# EAGLE design ChessMate (EAGLE 7.2.0)
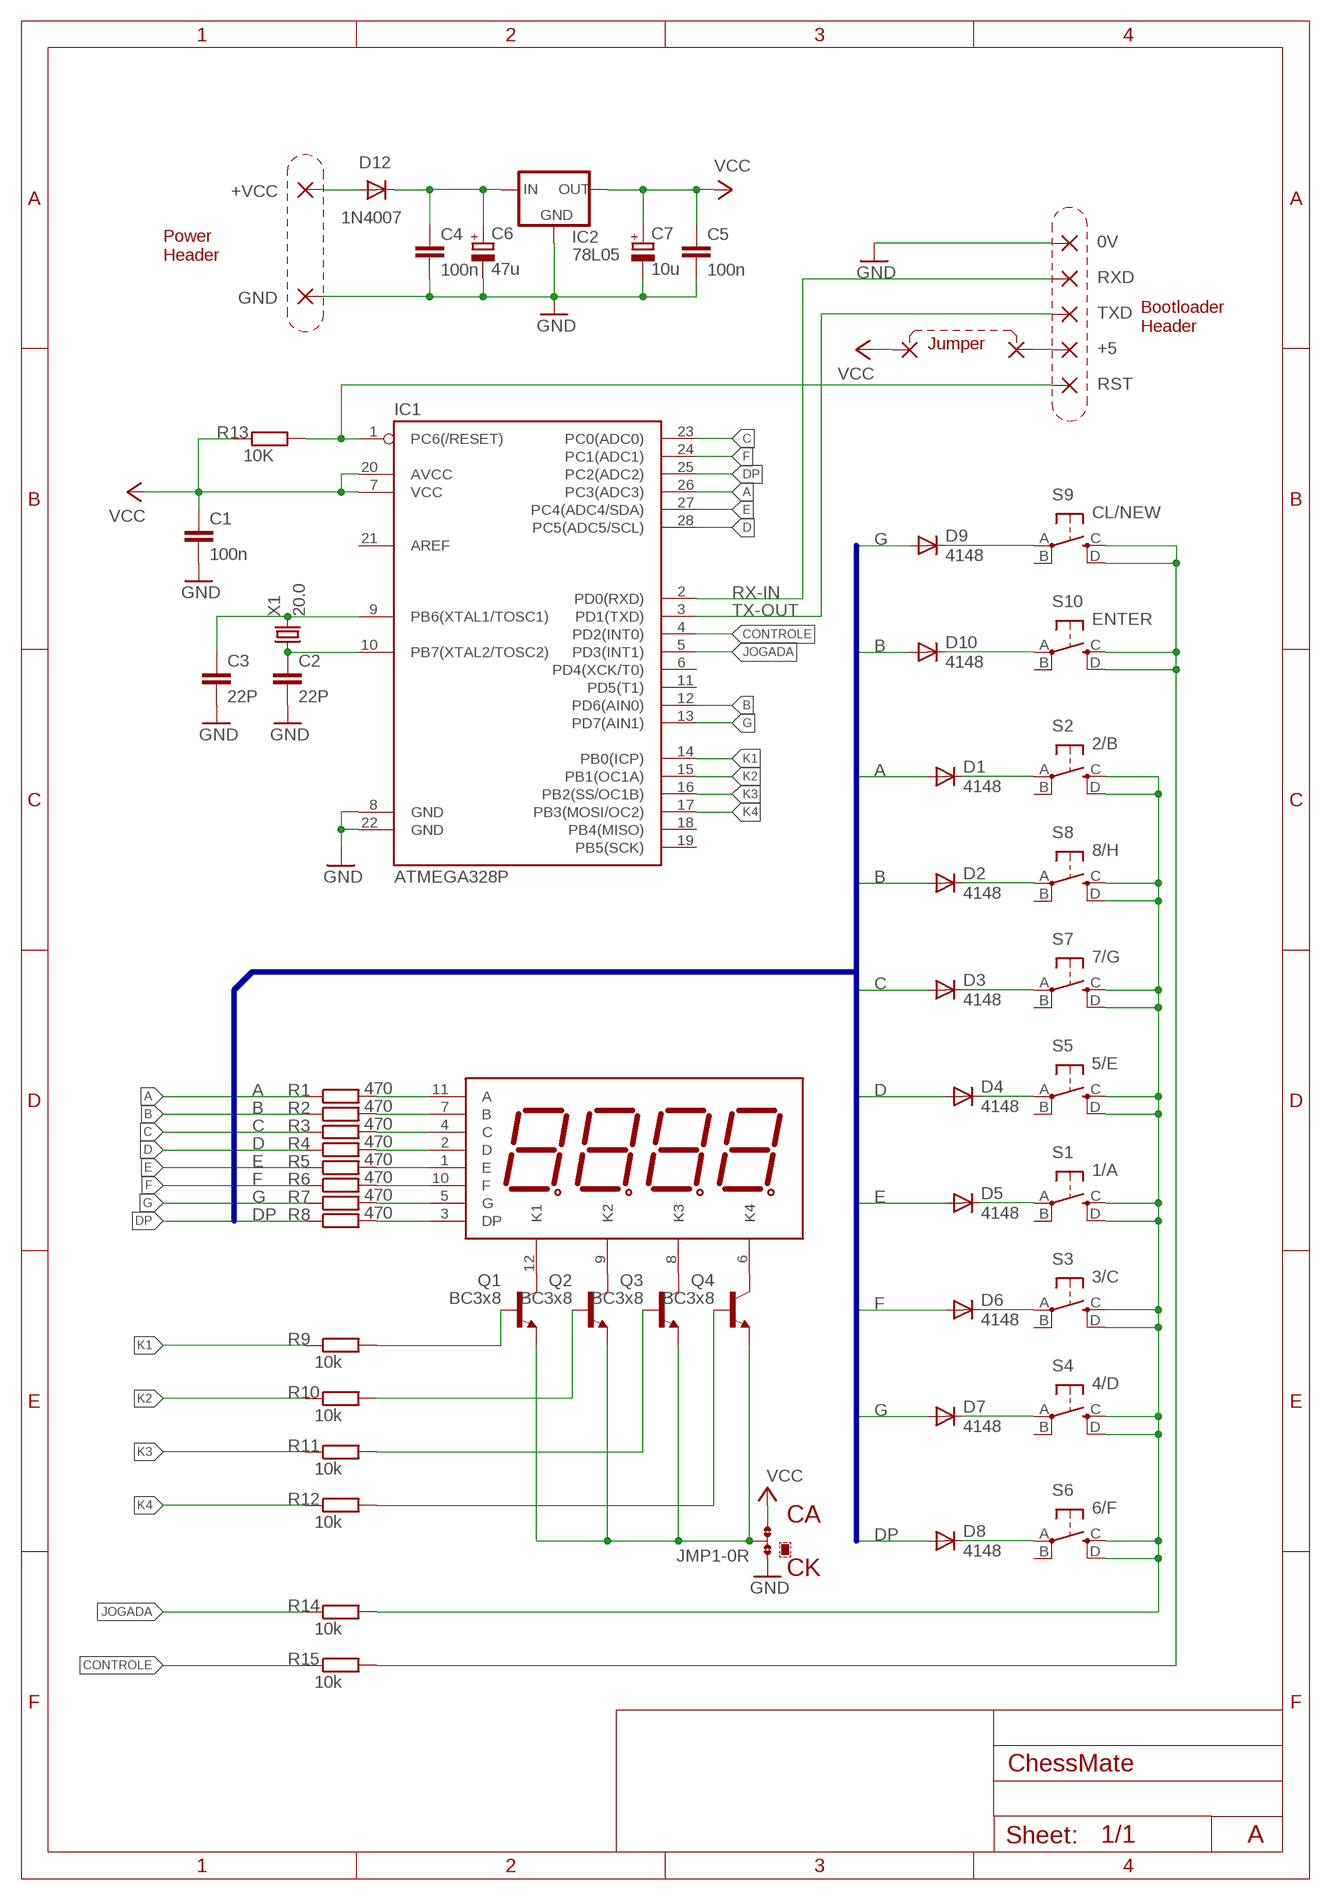
[diagram p0: schematic, sheet 1]

## Parts
0V  2,15/1,0  [2,15/1,0]
+5  2,15/1,0  [2,15/1,0]
+VCC  2,15/1,0  [2,15/1,0]
C1  100n  C-EUC050-024X044L  [C050-024X044L]
C2  22P  C-EU  [C025-024X044L]
C3  22P  C-EU  [C025-024X044L]
C4  100n  C-EUC050-024X044L  [C050-024X044L]
C5  100n  C-EUC050-024X044L  [C050-024X044L]
C6  47u  CPOL-EUTT2D7L  [TT2D7L]
C7  10u  CPOL-EUTT2D7L  [TT2D7L]
D1  4148  1N4148DO35-7  [DO35-7]
D2  4148  1N4148DO35-7  [DO35-7]
D3  4148  1N4148DO35-7  [DO35-7]
D4  4148  1N4148DO35-7  [DO35-7]
D5  4148  1N4148DO35-7  [DO35-7]
D6  4148  1N4148DO35-7  [DO35-7]
D7  4148  1N4148DO35-7  [DO35-7]
D8  4148  1N4148DO35-7  [DO35-7]
D9  4148  1N4148DO35-7  [DO35-7]
D10  4148  1N4148DO35-7  [DO35-7]
D12  1N4007  DIODE-DO41-7.7L  [DO41-7.6L]
GND  2,15/1,0  [2,15/1,0]
IC1  ATMEGA328P  ATMEGA328P_PDIP  [DIL28-3]
IC2  78L05  78LXXTO92_  [TO92_]
JMP1  0R-JUMPA  [A0R-JMP]
LD1  4_DIGIT-TOF3461BH-N  [TOF3461BH-N]
PAD1  1,6/0,8  [1,6/0,8]
PAD2  1,6/0,8  [1,6/0,8]
Q1  BC3x8  BC338  [TO92-EBC]
Q2  BC3x8  BC338  [TO92-EBC]
Q3  BC3x8  BC338  [TO92-EBC]
Q4  BC3x8  BC338  [TO92-EBC]
R1  470  R-EU_0204/7L  [0204/7L]
R2  470  R-EU_0204/7L  [0204/7L]
R3  470  R-EU_0204/7L  [0204/7L]
R4  470  R-EU_0204/7L  [0204/7L]
R5  470  R-EU_0204/7L  [0204/7L]
R6  470  R-EU_0204/7L  [0204/7L]
R7  470  R-EU_0204/7L  [0204/7L]
R8  470  R-EU_0204/7L  [0204/7L]
R9  10k  R-EU_0204/7L  [0204/7L]
R10  10k  R-EU_0204/7L  [0204/7L]
R11  10k  R-EU_0204/7L  [0204/7L]
R12  10k  R-EU_0204/7L  [0204/7L]
R13  10K  R-EU_0204/5L  [0204/5L]
R14  10k  R-EU_0204/7L  [0204/7L]
R15  10k  R-EU_0204/7L  [0204/7L]
RST  2,15/1,0  [2,15/1,0]
RXD  2,15/1,0  [2,15/1,0]
S1  1/A  10-XXTACT  [TACT_SW]
S2  2/B  10-XXTACT  [TACT_SW]
S3  3/C  10-XXTACT  [TACT_SW]
S4  4/D  10-XXTACT  [TACT_SW]
S5  5/E  10-XXTACT  [TACT_SW]
S6  6/F  10-XXTACT  [TACT_SW]
S7  7/G  10-XXTACT  [TACT_SW]
S8  8/H  10-XXTACT  [TACT_SW]
S9  CL/NEW  10-XXTACT  [TACT_SW]
S10  ENTER  10-XXTACT  [TACT_SW]
TXD  2,15/1,0  [2,15/1,0]
X1  20.0  CRYSTALHC49/SL  [HC49/SL]

## Nets
A: D1.A IC1.26(PC3(ADC3)) R1.1
B: D2.A D10.A IC1.12(PD6(AIN0)) R2.1
C: D3.A IC1.23(PC0(ADC0)) R3.1
CONTROLE: IC1.4(PD2(INT0)) R15.1
CONTROLE_: R15.2 S9.C(S) S9.D(S1) S10.C(S) S10.D(S1)
D: D4.A IC1.28(PC5(ADC5/SCL)) R4.1
DP: D8.A IC1.25(PC2(ADC2)) R8.1
E: D5.A IC1.27(PC4(ADC4/SDA)) R5.1
F: D6.A IC1.24(PC1(ADC1)) R6.1
G: D7.A D9.A IC1.13(PD7(AIN1)) R7.1
GND: 0V.1(P) C1.2 C2.2 C3.2 C4.2 C5.2 C6.- C7.- GND.1(P) IC1.8(GND) IC1.22(GND) IC2.2(GND) JMP1.1
JOGADA: IC1.5(PD3(INT1)) R14.1
JOGADA_C: R14.2 S1.C(S) S1.D(S1) S2.C(S) S2.D(S1) S3.C(S) S3.D(S1) S4.C(S) S4.D(S1) S5.C(S) S5.D(S1) S6.C(S) S6.D(S1) S7.C(S) S7.D(S1) S8.C(S) S8.D(S1)
K1: IC1.14(PB0(ICP)) R9.1
K2: IC1.15(PB1(OC1A)) R10.1
K3: IC1.16(PB2(SS/OC1B)) R11.1
K4: IC1.17(PB3(MOSI/OC2)) R12.1
N$1: LD1.11(A) R1.2
N$2: LD1.7(B) R2.2
N$3: LD1.4(C) R3.2
N$4: LD1.2(D) R4.2
N$5: LD1.1(E) R5.2
N$6: LD1.10(F) R6.2
N$7: LD1.5(G) R7.2
N$8: LD1.3(DP) R8.2
N$9: Q1.B R9.2
N$10: Q2.B R10.2
N$11: Q3.B R11.2
N$12: Q4.B R12.2
N$13: LD1.12(K1) Q1.C
N$14: LD1.9(K2) Q2.C
N$15: LD1.8(K3) Q3.C
N$16: LD1.6(K4) Q4.C
N$17: IC1.1(PC6(/RESET)) R13.2 RST.1(P)
N$18: C3.1 IC1.9(PB6(XTAL1/TOSC1)) X1.2
N$19: C2.1 IC1.10(PB7(XTAL2/TOSC2)) X1.1
N$20: +VCC.1(P) D12.A
N$21: D9.C S9.A(P)
N$22: D10.C S10.A(P)
N$23: D1.C S2.A(P)
N$24: D2.C S8.A(P)
N$25: D4.C S5.A(P)
N$26: D5.C S1.A(P)
N$27: D6.C S3.A(P)
N$28: D7.C S4.A(P)
N$29: D8.C S6.A(P)
N$30: D3.C S7.A(P)
N$32: +5.1(P) PAD2.1(P)
N$35: C4.1 C6.+ D12.C IC2.3(IN)
N$42: JMP1.2 Q1.E Q2.E Q3.E Q4.E
RX-IN: IC1.2(PD0(RXD)) RXD.1(P)
TX-OUT: IC1.3(PD1(TXD)) TXD.1(P)
VCC: C1.1 C5.1 C7.+ IC1.7(VCC) IC1.20(AVCC) IC2.1(OUT) JMP1.3 PAD1.1(P) R13.1
Unconnected: IC1.6(PD4(XCK/T0)) IC1.11(PD5(T1)) IC1.18(PB4(MISO)) IC1.19(PB5(SCK)) IC1.21(AREF) S1.B(P1) S2.B(P1) S3.B(P1) S4.B(P1) S5.B(P1) S6.B(P1) S7.B(P1) S8.B(P1) S9.B(P1) S10.B(P1)

## Buses
A,B,C,D,E,F,G,DP

## Notes on the sheet
- Power
  Header
- Bootloader
  Header
- Jumper
- CA
- CK
- A

## Library data of the parts
0V +5 +VCC GND RST RXD TXD = wirepad:2,15/1,0: THROUGH-HOLE PAD
C1-C5 = rcl:C-EU: CAPACITOR, European symbol
C6 C7 = rcl:CPOL-EU: POLARIZED CAPACITOR, European symbol
D1-D10 = XessMate:1N4148: DIODE high speed (Philips)
D12 = diode:DIODE-: DIODE
IC1 = SparkFun-DigitalIC:ATMEGA328P_PDIP: uC used in the Arduino 32kb flash, 1k EEPROM, 2k SRAM This is the through-hole version of this chip.
IC2 = XessMate:78LXX: VOLTAGE REGULATOR
JMP1 = jump-0r-smd:0R-JUMP: SMD 0R 0805 Jumper
LD1 = 7Segment-Displays:4_DIGIT: The HP QDSP-6064 are 2.79mm (.11"), micro seven segment GaAsP numeric indicators packaged in 4 digits end-stackable clusters.
PAD1 PAD2 = wirepad:1,6/0,8: THROUGH-HOLE PAD
Q1-Q4 = transistor-npn:BC338*: NPN Transistor
R1-R15 = rcl:R-EU_: RESISTOR, European symbol
S1-S10 = XessMate:10-XX: OMRON SWITCH
X1 = crystal:CRYSTAL: CRYSTAL

## Board
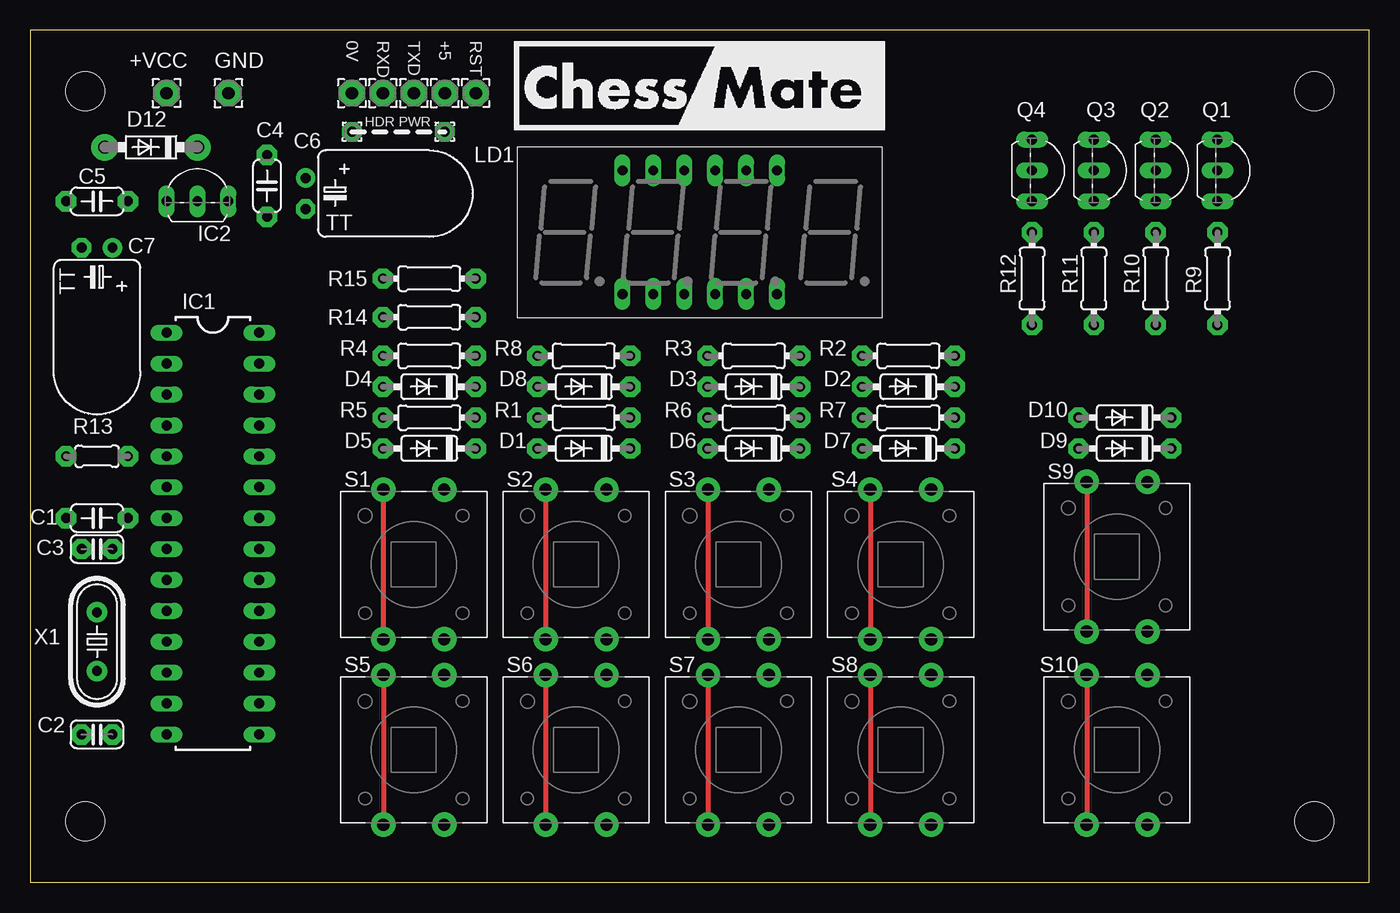
[diagram p1: board, top side]
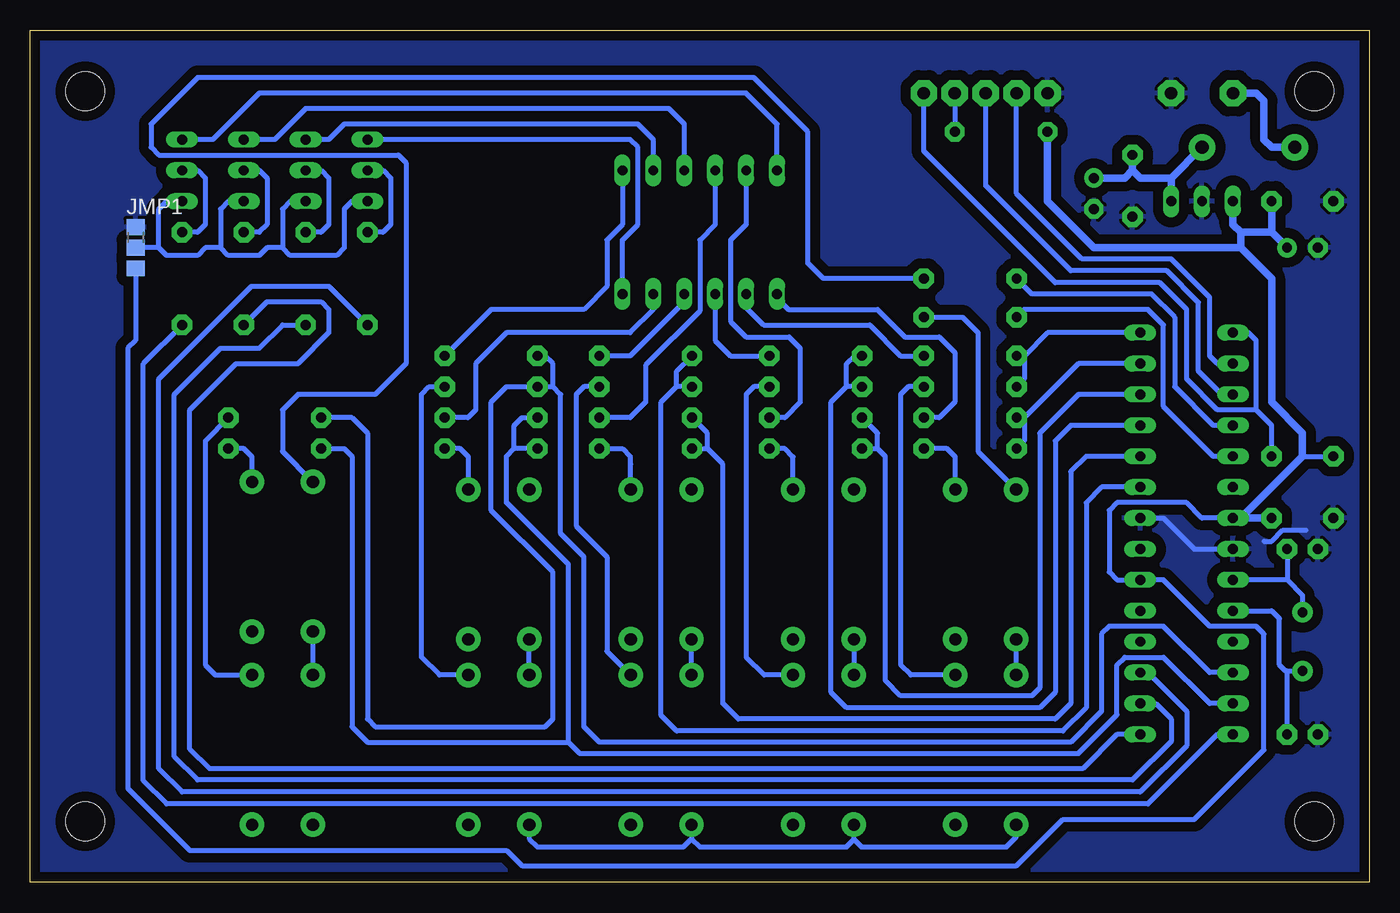
[diagram p2: board, bottom side, seen from below]

Size 110 x 70 mm. Coordinates in mm from the lower left corner, seen from the top.
Copper layers (1*16): Top 0.035mm / dielectric 1.5mm / Bottom 0.035mm
Design rules "default *": minimum track width 10mil, minimum drill 24mil, track to track 8mil, track to pad 8mil, pad to pad 8mil, via to via 8mil, smd to smd 8mil, copper to edge 25mil, drill to drill 8mil, minimum pad ring 10mil, minimum via ring 8mil, stop-mask expansion 4mil, vias tented up to drill 0mil, thermal gap 10mil

### Footprints (pad centres in the part's own frame; a part is rotated, then mirrored left to right if it is on the bottom)
2,15/1,0 = drill 1.016 pad 2.159 octagon: 1 0,0
C050-024X044L = drill 0.813 pad 1.676 octagon: 1 -2.54,0; 2 2.54,0
C025-024X044L = drill 0.813 pad 1.676 octagon: 1 -1.27,0; 2 1.27,0
TT2D7L = drill 0.813 pad 1.6: + -1.27,0 | drill 0.813 pad 1.6 octagon: - 1.27,0
DO35-7 = drill 0.813 pad 1.676 octagon: A 3.81,0; C -3.81,0
DO41-7.6L = drill 1.1 pad 2.184: A 3.81,0; C -3.81,0
DIL28-3 = drill 0.813 long: 1 -16.51,-3.81; 2 -13.97,-3.81; 3 -11.43,-3.81; 4 -8.89,-3.81; 5 -6.35,-3.81; 6 -3.81,-3.81; 7 -1.27,-3.81; 8 1.27,-3.81; 9 3.81,-3.81; 10 6.35,-3.81; 11 8.89,-3.81; 12 11.43,-3.81; 13 13.97,-3.81; 14 16.51,-3.81; 15 16.51,3.81; 16 13.97,3.81; 17 11.43,3.81; 18 8.89,3.81; 19 6.35,3.81; 20 3.81,3.81; 21 1.27,3.81; 22 -1.27,3.81; 23 -3.81,3.81; 24 -6.35,3.81; 25 -8.89,3.81; 26 -11.43,3.81; 27 -13.97,3.81; 28 -16.51,3.81
TO92_ = drill 0.813 long: 1 -2.54,0; 2 0,0; 3 2.54,0
A0R-JMP = smd 1.5 x 1.3: 1 0,1.7; 2 0,0; 3 0,-1.7
TOF3461BH-N = drill 0.8 long: 1 -6.35,-5.08; 2 -3.81,-5.08; 3 -1.27,-5.08; 4 1.27,-5.08; 5 3.81,-5.08; 6 6.35,-5.08; 7 6.35,5.08; 8 3.81,5.08; 9 1.27,5.08; 10 -1.27,5.08; 11 -3.81,5.08; 12 -6.35,5.08
1,6/0,8 = drill 0.813 pad 1.6 octagon: 1 0,0
TO92-EBC = drill 0.813 long: B 0,-1.27; C -2.54,-1.27; E 2.54,-1.27
0204/7L = drill 0.813 pad 1.676 octagon: 1 -3.81,0; 2 3.81,0
0204/5L = drill 0.813 pad 1.676 octagon: 1 -2.54,0; 2 2.54,0
TACT_SW = drill 1 pad 2: A -6.15,2.5; B 6.15,2.5; C -6.15,-2.5; D 6.15,-2.5
PB108_SMALL_HOLES = hole 3.2: -50.5,30; -50.5,-30; 50.5,-30; 50.5,30
HC49/SL = drill 0.813 pad 1.676: 1 -2.413,0; 2 2.413,0

### Placement (x,y rotation side)
0V  26.43,64.84 0 top
+5  34.05,64.84 0 top
+VCC  11.19,64.84 0 top
C1  5.47,29.92 180 top
C2  5.47,12.14 180 top
C3  5.47,27.38 180 top
C4  19.44,57.23 270 top
C5  5.47,55.96 180 top
C6  22.62,56.59 270 top
C7  5.47,52.15 180 top
D1  45.48,35.64 180 top
D2  72.15,40.72 180 top
D3  59.45,40.72 180 top
D4  32.78,40.72 180 top
D5  32.78,35.64 180 top
D6  59.45,35.64 180 top
D7  72.15,35.64 180 top
D8  45.48,40.72 180 top
D9  89.93,35.64 180 top
D10  89.93,38.18 180 top
D12  9.92,60.4 180 top
GND  16.27,64.84 0 top
IC1  15,28.65 270 top
IC2  13.73,55.96 0 top
JMP1  101.35,52.15 0 bottom
LD1  55,53.42 0 top
PAD1  26.43,61.67 0 top
PAD2  34.05,61.67 0 top
Q1  98.81,58.5 270 top
Q2  93.74,58.5 270 top
Q3  88.66,58.5 270 top
Q4  83.57,58.5 270 top
R1  45.48,38.18 0 top
R2  72.15,43.26 0 top
R3  59.45,43.26 0 top
R4  32.78,43.26 0 top
R5  32.78,38.18 0 top
R6  59.45,38.18 0 top
R7  72.15,38.18 0 top
R8  45.48,43.26 0 top
R9  97.55,49.61 90 top
R10  92.47,49.61 90 top
R11  87.38,49.61 90 top
R12  82.31,49.61 90 top
R13  5.47,35 0 top
R14  32.78,46.43 0 top
R15  32.78,49.61 0 top
RST  36.59,64.84 0 top
RXD  28.97,64.84 0 top
S1  31.51,26.11 270 top
S2  44.84,26.11 270 top
S3  58.18,26.11 270 top
S4  71.51,26.11 270 top
S5  31.51,10.87 270 top
S6  44.84,10.87 270 top
S7  58.18,10.87 270 top
S8  71.51,10.87 270 top
S9  89.29,26.75 270 top
S10  89.29,10.87 270 top
TXD  31.51,64.84 0 top
U$1  [PB108_SMALL_HOLES]  55,35 0 top
X1  5.47,19.76 90 top

### Tracks (layer width: path | path; a pad name or v marks a point on that pad's centre or on a via)
A
  Bottom 0.406: IC1.26 23.89,40.08 27.06,36.91 27.06,15.95 27.7,15.32 38.49,15.32 39.76,16.59 39.76,35 40.4,35.64 | 40.4,35.64 40.4,36.91 R1.1 | D1.A 40.4,35.64
B
  Bottom 0.406: IC1.12 13.09,17.22 16.9,21.03 21.35,21.03 21.98,20.4 21.98,14.05 24.52,11.51 63.26,11.51 64.53,12.78 64.53,26.75 66.43,28.65 66.43,40.08 67.06,40.72 | 67.06,40.72 67.06,42.62 67.7,43.26 R2.1 | 67.06,40.72 D2.A 70.88,40.72 72.15,39.45 72.15,30.56 67.06,25.48 67.06,13.41 67.7,12.78 81.67,12.78 82.31,13.41 82.31,36.91 83.57,38.18 D10.A
C
  Bottom 0.406: IC1.23 21.98,32.46 23.25,31.19 23.25,14.33 25.16,12.43 56.91,12.43 58.18,13.7 58.18,39.45 56.91,40.72 | 56.91,40.72 56.91,41.98 R3.1 | D3.A 56.91,40.72
CONTROLE
  Bottom 0.406: IC1.4 12.8,37.54 15.98,40.72 15.98,46.43 17.88,48.34 27.7,48.34 R15.1
CONTROLE_
  Top 0.406: S9.C S9.D | S10.C S10.D
  Bottom 0.406: R15.2 44.84,49.61 46.11,50.88 46.11,61.67 50.55,66.12 96.28,66.12 100.09,62.3 100.09,60.4 99.45,59.77 79.77,59.77 79.13,59.13 79.13,42.62 81.67,40.08 88.02,40.08 89.29,38.81 89.29,35.4 S9.C | S9.D S10.C
D
  Bottom 0.406: IC1.28 26.43,45.16 28.33,43.26 | 28.33,43.26 28.33,41.35 D4.A | R4.1 28.33,43.26
DP
  Bottom 0.406: IC1.25 24.52,37.54 25.79,36.27 25.79,15.6 27.06,14.33 42.94,14.33 44.21,15.6 44.21,39.45 42.94,40.72 | 42.94,40.72 42.94,42.62 42.3,43.26 R8.1 | D8.A 42.94,40.72
E
  Bottom 0.406: IC1.27 23.89,42.62 28.33,38.18 | 28.33,38.18 28.33,36.27 D5.A | 28.33,38.18 R5.1
F
  Bottom 0.406: IC1.24 23.25,35 24.52,33.73 24.52,14.68 25.79,13.41 51.83,13.41 53.1,14.68 53.1,34.37 54.37,35.64 | 54.37,35.64 54.37,36.91 R6.1 | D6.A 54.37,35.64
G
  Bottom 0.406: 65.8,11.51 64.87,10.58 23.89,10.58 20.71,13.76 20.71,17.86 20.08,18.49 16.9,18.49 13.09,14.68 IC1.13 | 65.8,11.51 65.8,26.11 70.88,31.19 70.88,35 70.24,35.64 | 70.24,35.64 70.24,37.54 69.6,38.18 R7.1 | D7.A 70.24,35.64 | D9.A 84.21,35.64 83.57,35 83.57,12.78 82.31,11.51 65.8,11.51
GND
  Bottom 0.406: IC1.22 16.9,29.92 14.36,27.38 IC1.8 10.55,27.38 | C1.2 2.93,29.29 | 8.65,28.02 8.01,28.02 7.09,28.94 5.18,28.94
  pour Bottom (isolate 0.813): -0.24,0.08 110.25,0.08 110.25,69.92 -0.24,69.92
JOGADA
  Bottom 0.406: IC1.5 12.8,35 16.9,39.1 16.9,45.8 18.17,47.07 28.33,47.07 R14.1
JOGADA_C
  Top 0.406: S4.C S4.D | S8.C S8.D | S7.C S7.D | S3.C S3.D | S2.C S2.D | S6.C S6.D | S5.C S5.D | S1.D S1.C
  Bottom 0.406: R14.2 33.41,46.43 32.14,45.16 32.14,35.4 S1.C | S7.D 55.68,3.58 | 55.68,3.58 55,2.9 42.94,2.9 42.33,3.5 | S8.D 69.01,3.58 68.34,2.9 56.35,2.9 55.68,3.58 | S1.D S5.C | S2.D S6.C | S7.C S3.D | S8.C S4.D | 42.33,3.5 41.73,2.9 29.79,2.9 29.01,3.69 S5.D | 42.33,3.5 42.33,4.71 S6.D
K1
  Bottom 0.406: IC1.14 12.46,12.14 18.17,6.43 98.81,6.43 100.72,8.33 100.72,42.62 R9.1
K2
  Bottom 0.406: IC1.15 20.71,12.14 23.54,9.31 95.29,9.31 96.91,10.93 96.91,38.81 93.1,42.62 88.02,42.62 85.48,45.16 85.48,47.07 86.12,47.7 90.56,47.7 R10.1
K3
  Bottom 0.406: IC1.16 17.54,14.68 16.27,13.41 16.27,11.57 19.44,8.39 96.28,8.39 98.18,10.3 98.18,40.08 94.37,43.89 91.19,43.89 89.29,45.8 R11.1
K4
  Bottom 0.406: IC1.17 18.17,17.22 15,14.05 15,11.22 18.81,7.41 97.55,7.41 99.45,9.31 99.45,41.35 91.83,48.97 85.48,48.97 R12.1
N$1
  Bottom 0.406: LD1.11 51.19,54.05 52.46,52.78 52.46,46.08 51.19,44.81 47.67,44.81 46.75,43.89 46.75,39.45 48.02,38.18 R1.2
N$2
  Bottom 0.406: LD1.7 61.35,54.05 62.62,52.78 62.62,48.97 64.53,47.07 72.15,47.07 R2.2
N$3
  Bottom 0.406: R3.2 60.72,43.26 56.27,47.7 LD1.4
N$4
  Bottom 0.406: R4.2 38.49,43.26 41.03,45.8 49.76,45.8 51.19,47.22 LD1.2
N$5
  Bottom 0.406: R5.2 35.32,38.18 34.05,39.45 34.05,43.54 35.32,44.81 38.14,44.81 40.4,47.07 47.73,47.07 48.65,47.99 LD1.1
N$6
  Bottom 0.406: LD1.10 53.73,54.05 55,52.78 55,46.94 59.45,42.49 59.45,39.45 60.72,38.18 R6.2
N$7
  Bottom 0.406: LD1.5 58.81,47.07 60.72,45.16 70.88,45.16 73.41,42.62 73.41,38.81 74.05,38.18 R7.2
N$8
  Bottom 0.406: LD1.3 53.73,47.07 53.73,44.53 52.46,43.26 R8.2
N$9
  Bottom 0.406: Q1.B 96.28,58.5 95.64,57.86 95.64,54.05 96.28,53.42 R9.2
N$10
  Bottom 0.406: Q2.B 91.19,58.5 90.56,57.86 90.56,54.05 91.19,53.42 R10.2
N$11
  Bottom 0.406: Q3.B 86.12,58.5 85.48,57.86 85.48,54.05 86.12,53.42 R11.2
N$12
  Bottom 0.406: Q4.B 81.03,58.5 80.4,57.86 80.4,54.05 81.03,53.42 R12.2
N$13
  Bottom 0.406: LD1.12 48.65,62.3 51.19,64.84 91.19,64.84 95,61.04 Q1.C
N$14
  Bottom 0.406: LD1.9 56.27,62.3 57.54,63.58 87.38,63.58 89.93,61.04 Q2.C
N$15
  Bottom 0.406: LD1.8 58.81,61.04 60.08,62.3 84.21,62.3 85.48,61.04 Q3.C
N$16
  Bottom 0.406: LD1.6 61.35,52.78 60.08,54.05 60.08,60.4 60.72,61.04 Q4.C
N$17
  Bottom 0.406: R13.2 8.01,37.54 9.28,38.81 | 9.28,38.81 9.28,44.53 9.92,45.16 IC1.1 | 9.28,38.81 12.46,38.81 15,41.35 15,47.07 17.19,49.26 25.79,49.26 32.78,56.24 32.78,56.27 36.59,60.08 RST.1
N$18
  Bottom 0.406: C3.1 6.74,24.84 | 6.74,24.84 IC1.9 | 6.74,24.84 5.47,23.57 X1.2
N$19
  Bottom 0.406: IC1.10 8.01,22.3 7.38,21.67 7.38,17.86 6.87,17.35 6.74,17.35 | C2.1 6.74,17.35 | 6.74,17.35 X1.1
N$20
  Bottom 0.61: D12.A 8.01,60.4 8.65,61.04 8.65,64.21 9.28,64.84 +VCC.1
N$21
  Bottom 0.406: S9.A 91.79,34.96 92.47,35.64 D9.C
N$22
  Bottom 0.406: D10.C 95.64,36.27 95.64,17.86 94.81,17.02 S10.A
N$23
  Bottom 0.406: S2.A 47.34,34.96 48.02,35.64 D1.C
N$24
  Bottom 0.406: S8.A 76.39,17.02 77.86,18.49 77.86,40.08 77.22,40.72 D2.C
N$25
  Bottom 0.406: D4.C 37.86,40.72 38.49,40.08 38.49,17.86 37.66,17.02 S5.A
N$26
  Bottom 0.406: S1.A 34.01,34.96 34.68,35.64 D5.C
N$27
  Bottom 0.406: S3.A 60.68,34.33 60.72,34.37 60.72,35 61.35,35.64 D6.C
N$28
  Bottom 0.406: S4.A 74.01,34.96 74.69,35.64 D7.C
N$29
  Bottom 0.406: S6.A 49.72,17.02 51.19,18.49 51.19,38.81 51.19,40.08 50.55,40.72 D8.C
N$30
  Bottom 0.406: D3.C 64.53,40.72 65.16,40.08 65.16,29.29 62.62,26.75 62.62,18.97 S7.A
N$32
  Bottom 0.406: +5.1 PAD2.1
N$35
  Bottom 0.61: D12.C 16.27,57.86 | 16.27,57.86 18.81,57.86 19.44,58.5 | 19.44,58.5 20.08,57.86 C6.+ | C4.1 19.44,58.5 | IC2.3 16.27,57.86
N$42
  Bottom 0.406: Q4.E 83.57,55.96 84.21,55.32 84.21,52.15 84.84,51.51 88.66,51.51 89.29,52.15 | 89.29,52.15 90.56,52.15 91.19,51.51 93.74,51.51 94.37,52.15 | 94.37,52.15 95.64,52.15 96.28,51.51 98.81,51.51 99.45,52.15 | 99.45,52.15 99.45,55.32 98.81,55.96 Q1.E | Q2.E 93.74,55.96 94.37,55.32 94.37,52.15 | Q3.E 88.66,55.96 89.29,55.32 89.29,52.15 | 99.45,52.15 JMP1.2
RX-IN
  Bottom 0.406: IC1.2 12.46,42.62 13.09,43.26 13.09,48.05 16.27,51.22 23.6,51.22 28.97,56.59 RXD.1
TX-OUT
  Bottom 0.406: IC1.3 12.11,40.08 14.01,41.98 14.01,47.64 16.61,50.24 24.52,50.24 31.51,57.23 TXD.1
VCC
  Bottom 0.406: 10.55,29.92 IC1.7 13.73,29.92 15,31.19 20.71,31.19 21.35,30.56 21.35,25.48 20.71,24.84 IC1.20 16.9,24.84 13.09,21.03 9.28,21.03 8.65,20.4 8.65,10.87 14.36,5.16 25.16,5.16 28.97,1.35 69.6,1.35 70.88,2.62 96.91,2.62 101.99,7.7 101.99,43.89 101.35,44.53 JMP1.3 | 5.47,35 R13.1
  Bottom 0.61: C1.1 10.55,29.92 5.47,35 5.47,36.91 8.01,39.45 8.01,49.61 10.55,52.15 | C5.1 8.01,53.42 | C7.+ 8.01,53.42 | PAD1.1 26.43,55.96 22.62,52.15 10.55,52.15 | 8.01,53.42 10.55,53.42 | 10.55,53.42 11.19,54.05 IC2.1 | 10.55,52.15 10.55,53.42

### Text on the board
tPlace: HDR PWR